# EAGLE design tiny_metal_detector (EAGLE 8.6.3)
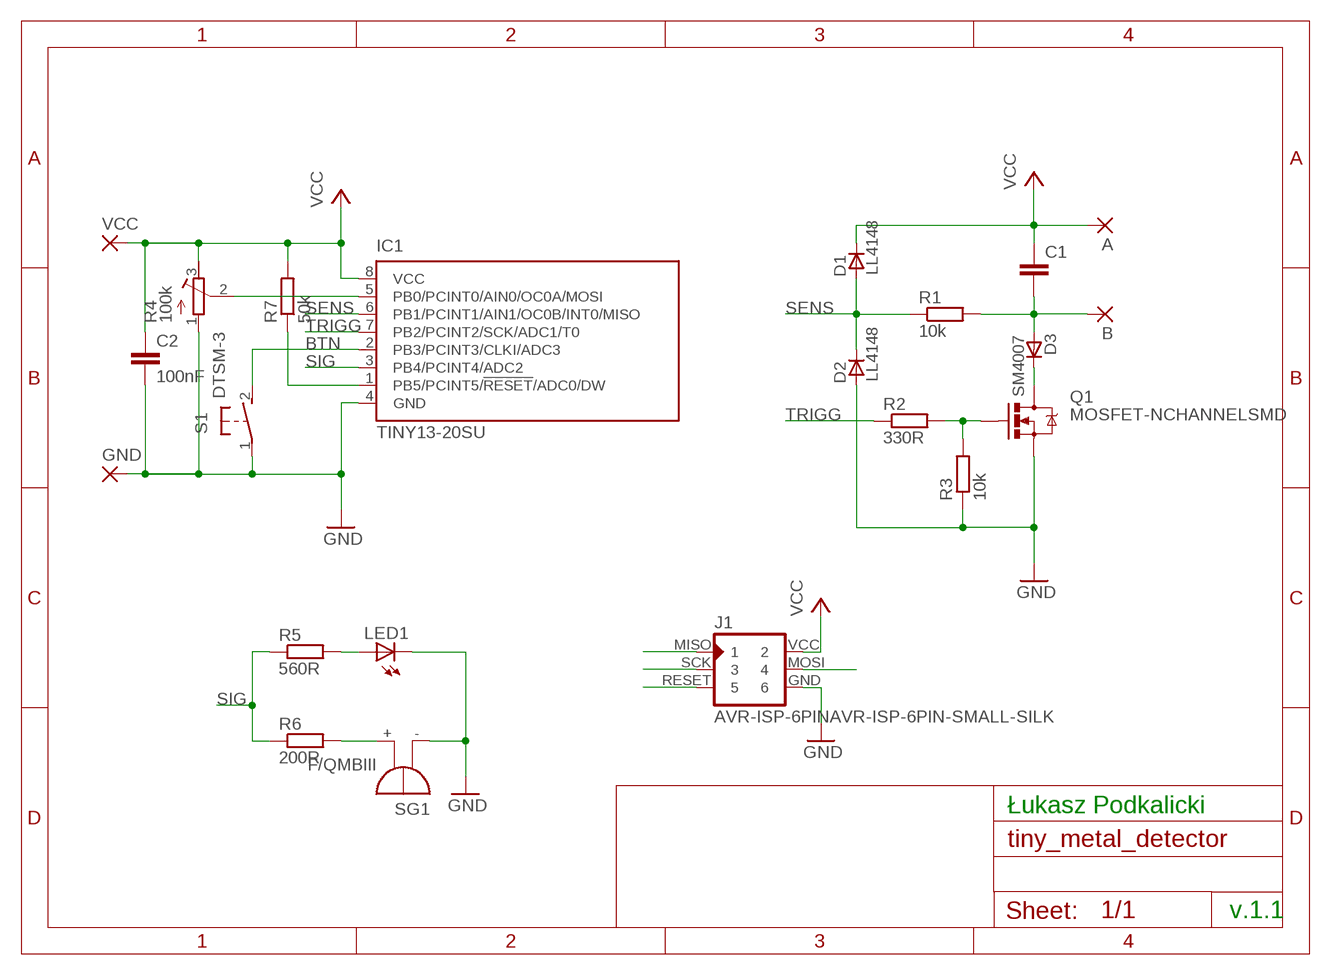
[diagram p0: schematic, sheet 1]
FRAME1 (DINA5_L): AUTHOR: Łukasz Podkalicki; SPICEPREFIX: X

## Parts
A  3,17/1,1  [3,17/1,1]
B  3,17/1,1  [3,17/1,1]
C1  C-EUC1206K  [C1206K]
C2  100nF  C-EUC1206K  [C1206K]
D1  LL4148  [SOD80_DO213AA_MINIMELF]
D2  LL4148  [SOD80_DO213AA_MINIMELF]
D3  SM4007  [MELF-MLL41_DO213AB]
GND  3,17/1,1  [3,17/1,1]
IC1  TINY13-20SU  [8S2]
J1  AVR-ISP-6PINAVR-ISP-6PIN-SMALL-SILK  [AVR-ISP-6PIN-SMAILL-SILK]
LED1  LEDCHIPLED_1206  [CHIPLED_1206]
Q1  MOSFET-NCHANNELSMD  [SOT23-3]
R1  10k  R-EU_R1206  [R1206]
R2  330R  R-EU_R1206  [R1206]
R3  10k  R-EU_R1206  [R1206]
R4  100k  R-TRIMM3296W  [RTRIM3296W]
R5  560R  R-EU_R1206  [R1206]
R6  200R  R-EU_R1206  [R1206]
R7  50k  R-EU_R1206  [R1206]
S1  DTSM-3  [DTSM-3]
SG1  F/QMBIII  [F/QMBIII]
VCC  3,17/1,1  [3,17/1,1]

## Nets
BTN: IC1.2(PB3/PCINT3/CLKI/ADC3) S1.2
GND: C2.2 D2.A GND.1(P) IC1.4(GND) J1.GND LED1.C Q1.2(S) R3.1 R4.1(A) S1.1 SG1.-(+)
MOSI: IC1.5(PB0/PCINT0/AIN0/OC0A/MOSI) J1.MOSI R4.2(S)
N$1: R6.2 SG1.+(-)
N$4: B.1(P) C1.2 D3.A R1.2
N$5: D3.C Q1.3(D)
N$6: Q1.1(G) R2.2 R3.2
N$7: LED1.A R5.2
RESET: IC1.1(PB5/PCINT5/!RESET!/ADC0/DW) J1.RESET R7.1
SENS: D1.A D2.C IC1.6(PB1/PCINT1/AIN1/OC0B/INT0/MISO) J1.MISO R1.1
SIG: IC1.3(PB4/PCINT4/ADC2) R5.1 R6.1
TRIGG: IC1.7(PB2/PCINT2/SCK/ADC1/T0) J1.SCK R2.1
VCC: A.1(P) C1.1 C2.1 D1.C IC1.8(VCC) J1.VCC R4.3(E) R7.2 VCC.1(P)

## Notes on the sheet
- Łukasz Podkalicki
- v.1.1

## Library data of the parts
A B GND VCC = wirepad:3,17/1,1: THROUGH-HOLE PAD
C1 C2 = rcl:C-EU: CAPACITOR, European symbol
D1 D2 = _hhn_diodes_smd:LL4148: 1N4148 General Purpose Rectifie SMD-Version of 1N4148 Case: SOD 80 = DO 213 AA = MINIMELF (Glass) Author: Dipl.-Ing. FH Rainer Bayer HHN Hochschule Heilbronn, rainer.bayer@hs-heilbronn.de Ingenieurbüro ing-rb, mail@ing-rb.de
D3 = _hhn_diodes_smd:SM400*: SM4001 .. SM4007 General Purpose Rectifier, 1 A SMD-Version of 1N4001 .. 1N4007 Case: MELF-MLL41 = DO 213 AB Author: Dipl.-Ing. FH Rainer Bayer HHN Hochschule Heilbronn, rainer.bayer@hs-heilbronn.de Ingenieurbüro ing-rb, mail@ing-rb.de
IC1 = atmel:TINY13: 8-bit AVR Microcontroller with 1K Bytes In-System Programmable Flash Source: http://www.atmel.com/dyn/resources/prod_documents/2535S.pdf; MPN: ATTINY13-20SU; OC_FARNELL: 9171568; OC_NEWARK: 96K6522
J1 = avr-isp:AVR-ISP-6PIN: AVR ISP 6pin 3x2 pin header
LED1 = led:LED: LED OSRAM: - CHIPLED LG R971, LG N971, LY N971, LG Q971, LY Q971, LO R971, LY R971 LH N974, LH R974 LS Q976, LO Q976, LY Q976 LO Q996 - Hyper CHIPLED LW Q18S LB Q993, LB Q99A, LB R99A - SideLED LS A670, LO A670, LY A670, LG A670, LP A670 LB A673, LV A673, LT A673, LW A673 LH A674 LY A675 LS A676, LA A676, LO A676, LY A676, LW A676 LS A679, LY A679, LG A679 - Hyper Micro SIDELED® LS Y876, LA Y876, LO Y876, LY Y876 LT Y87S - SmartLED LW L88C, LW L88S LB L89C, LB L89S, LG L890 LS L89K, LO L89K, LY L89K LS L896, LA L896, LO L896, LY L896 - TOPLED LS T670, LO T670, LY T670, LG T670, LP T670 LSG T670, LSP T670, LSY T670, LOP T670, LYG T670 LG T671, LOG T671, LSG T671 LB T673, LV T673, LT T673, LW T673 LH T674 LS T676, LA T676, LO T676, LY T676, LB T676, LH T676, LSB T676, LW T676 LB T67C, LV T67C, LT T67C, LS T67K, LO T67K, LY T67K, LW E67C LS E67B, LA E67B, LO E67B, LY E67B, LB E67C, LV E67C, LT E67C LW T67C LS T679, LY T679, LG T679 LS T770, LO T770, LY T770, LG T770, LP T770 LB T773, LV T773, LT T773, LW T773 LH T774 LS E675, LA E675, LY E675, LS T675 LS T776, LA T776, LO T776, LY T776, LB T776 LHGB T686 LT T68C, LB T68C - Hyper Mini TOPLED® LB M676 - Mini TOPLED Santana® LG M470 LS M47K, LO M47K, LY M47K Source: http://www.osram.convergy.de LUXEON: - LUMILED® LXK2-PW12-R00, LXK2-PW12-S00, LXK2-PW14-U00, LXK2-PW14-V00 LXK2-PM12-R00, LXK2-PM12-S00, LXK2-PM14-U00 LXK2-PE12-Q00, LXK2-PE12-R00, LXK2-PE12-S00, LXK2-PE14-T00, LXK2-PE14-U00 LXK2-PB12-K00, LXK2-PB12-L00, LXK2-PB12-M00, LXK2-PB14-N00, LXK2-PB14-P00, LXK2-PB14-Q00 LXK2-PR12-L00, LXK2-PR12-M00, LXK2-PR14-Q00, LXK2-PR14-R00 LXK2-PD12-Q00, LXK2-PD12-R00, LXK2-PD12-S00 LXK2-PH12-R00, LXK2-PH12-S00 LXK2-PL12-P00, LXK2-PL12-Q00, LXK2-PL12-R00 Source: www.luxeon.com KINGBRIGHT: KA-3528ASYC Source: www.kingbright.com
Q1 = fets:MOSFET-NCHANNEL: Generic NMOS footprint
R1-R3 R5-R7 = rcl:R-EU_: RESISTOR, European symbol
R4 = rcl:R-TRIMM: Trimm resistor
S1 = switch-tact-custom:DTSM-3
SG1 = buzzer:F/QMBIII: BUZZER Source: Buerklin; OC_FARNELL: unknown; OC_NEWARK: unknown

## Board
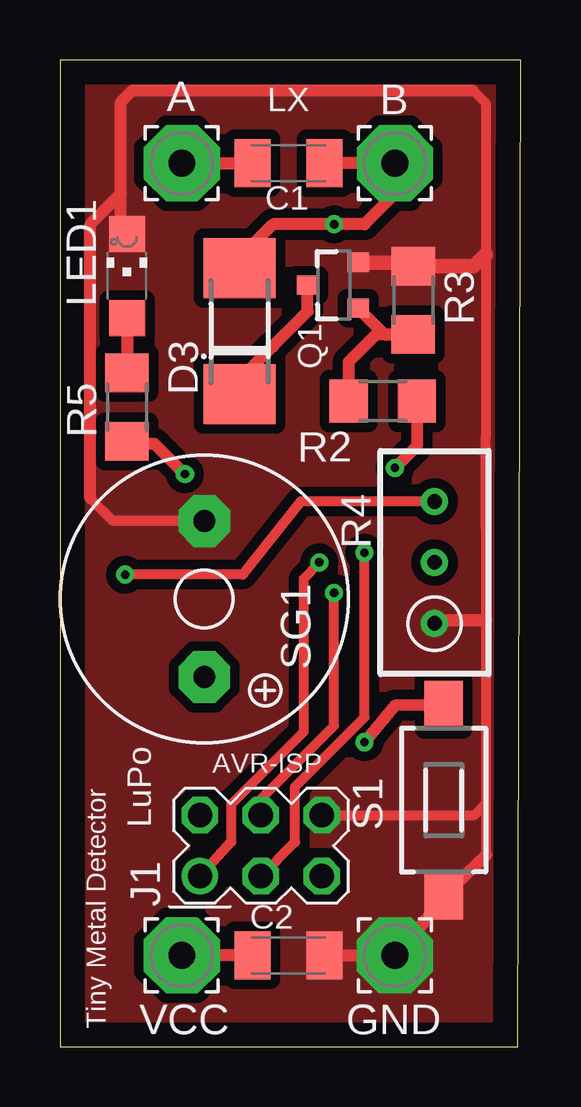
[diagram p1: board, top side]
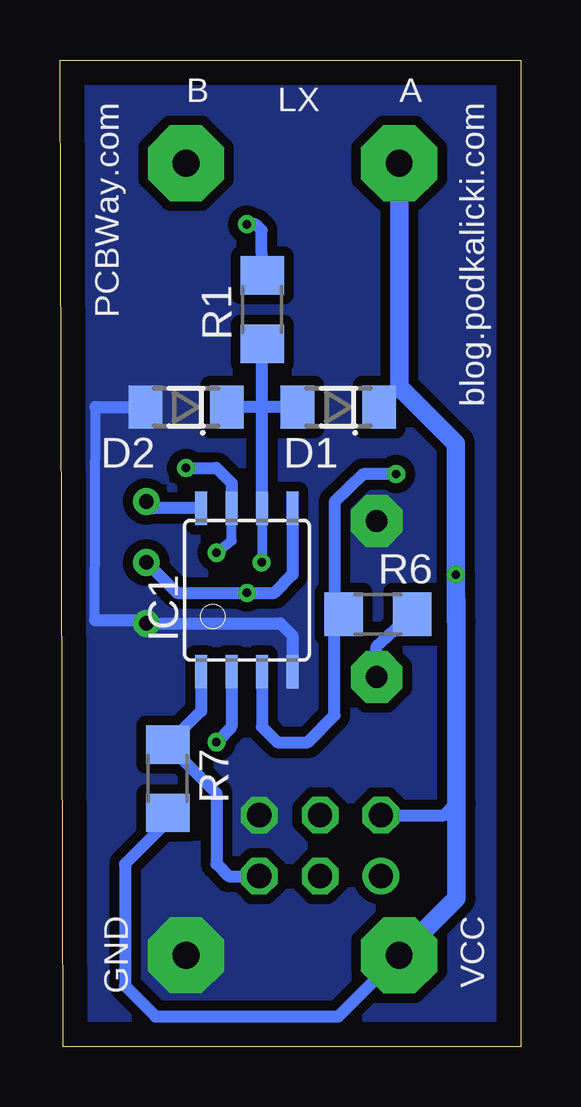
[diagram p2: board, bottom side, seen from below]

Size 19.23 x 41.14 mm. Coordinates in mm from the lower left corner, seen from the top.
Outline: 0,0 19.1,0 19.23,41.14 0,41.14 0,0
Copper layers (1*16): Top 0.035mm / dielectric 1.5mm / Bottom 0.035mm
Design rules "default": minimum track width 6mil, minimum drill 0.35mm, track to track 6mil, track to pad 6mil, pad to pad 6mil, via to via 6mil, smd to smd 6mil, copper to edge 40mil, drill to drill 6mil, minimum pad ring 10mil, minimum via ring 8mil, stop-mask expansion 4mil, vias tented up to drill 0mil, thermal gap 10mil

### Footprints (pad centres in the part's own frame; a part is rotated, then mirrored left to right if it is on the bottom)
3,17/1,1 = drill 1.118 pad 3.175 octagon: 1 0,0
C1206K = smd 1.5 x 2: 1 -1.5,0; 2 1.5,0
SOD80_DO213AA_MINIMELF = smd 1.4 x 1.8: A 1.7,0; C -1.7,0
MELF-MLL41_DO213AB = smd 2.5 x 3: A 2.625,0; C -2.625,0
8S2 = smd 0.5 x 1.4: 1 -1.905,-3.404; 2 -0.645,-3.404; 3 0.625,-3.404; 4 1.895,-3.404; 5 1.905,3.404; 6 0.635,3.404; 7 -0.635,3.404; 8 -1.905,3.404
AVR-ISP-6PIN-SMAILL-SILK = drill 1.016 octagon: GND 1.27,-2.54; MOSI 1.27,0; RESET -1.27,-2.54; SCK -1.27,0; VCC 1.27,2.54 | drill 1.016: MISO -1.27,2.54
CHIPLED_1206 = smd 1.5 x 1.5: A 0,-1.75; C 0,1.75
SOT23-3 = smd 0.8 x 0.9: 1 -0.95,-1; 2 0.95,-1; 3 0,1.1
R1206 = smd 1.6 x 1.803: 1 -1.422,0; 2 1.422,0
RTRIM3296W = drill 0.61: 1 0,-2.54; 2 0,0; 3 0,2.54
DTSM-3 = smd 2 x 1.6: 1 -3.97,0; 2 3.97,0
F/QMBIII = drill 0.914 pad 2.159 octagon: + 3.251,0; - -3.251,0

### Placement (x,y rotation side)
A  5.08,36.83 0 top
B  13.97,36.83 0 top
C1  9.53,36.83 0 top
C2  9.53,3.81 0 top
D1  7.62,26.67 180 bottom
D2  13.97,26.67 180 bottom
D3  7.49,29.84 90 top
GND  13.97,3.81 0 top
IC1  11.43,19.05 0 bottom
J1  8.38,8.38 90 top
LED1  2.79,32.13 0 top
Q1  11.43,31.75 90 top
R1  10.79,30.73 90 bottom
R2  13.46,26.92 180 top
R3  14.73,31.11 270 top
R4  15.62,20.19 0 top
R5  2.79,26.67 90 top
R6  5.97,18.03 0 bottom
R7  14.73,11.18 270 bottom
S1  16,10.29 90 top
SG1  6.02,18.67 270 top
VCC  5.08,3.81 0 top

### Tracks (layer width: path | path; a pad name or v marks a point on that pad's centre or on a via)
BTN  (via drill 0.35)
  Top 0.508: S1.2 13.97,14.22 v12.7,12.7
  Bottom 0.508: IC1.2 12.07,13.35 v12.7,12.7
GND
  Top 0.406: 17.78,8 17.78,10.16 | 17.78,10.16 17.78,15.25 17.78,17.78 17.75,25.4 17.75,33.02 17.75,39.33 17.21,39.87 | J1.GND 17.27,9.65 17.78,10.16 | SG1.- 2.21,21.92 1.27,22.86
  Top 0.508: C2.2 GND.1 15.11,5.11 S1.1 17.78,8 | 17.78,17.78 15.75,17.78 R4.1 | LED1.C 2.54,34.13 2.54,35.56 | 2.54,35.56 2.54,39.37 3.04,39.87 17.21,39.87 | 2.54,35.56 1.27,34.29 1.27,22.86
  Top 0.61: Q1.2 14.57,32.7 R3.1 17.27,32.54 17.75,33.02
  Bottom 0.406: 17.78,17.78 17.75,26.67
  Bottom 0.508: IC1.4 9.54,17.16 10.03,17.65 R4.1 15.75,17.78 17.78,17.78 | 17.75,26.67 D2.A | D2.A
  pour Bottom (isolate 0.406, no thermals): -0.25,41.53 19.05,41.4 19.05,0 0,0
  pour Top (isolate 0.406, no thermals): -1.27,41.91 20.32,41.91 20.32,-1.27 -1.27,-1.27
MOSI  (via drill 0.35)
  Top 0.406: J1.MOSI 8.36,9.75 8.36,10.31 11.43,13.38 v11.43,18.92
  Bottom 0.508: IC1.5 9.53,19.68 10.29,18.92 v11.43,18.92 14.35,18.92 R4.2
N$1
  Bottom 0.406: 5.94,16 SG1.+
  Bottom 0.508: SG1.+ 6.02,16.69 R6.2
N$4  (via drill 0.35)
  Top 0.508: 6.9,32.47 D3.A 7.49,32.89 8.89,34.29 v11.43,34.29 12.7,34.29 13.97,35.56 B.1 C1.2
  Bottom 0.508: R1.2 10.82,34.04 11.07,34.29 v11.43,34.29
N$5
  Top 0.508: D3.C 7.62,27.35 7.62,27.94 8.89,29.21 10.33,30.65 Q1.3
N$6
  Top 0.508: Q1.1 13.54,29.69 R3.2 13.18,29.69 12.04,28.55 R2.2
N$7
  Top 0.508: LED1.A R5.2
RESET
  Bottom 0.508: IC1.1 13.34,13.99 R7.1 12.7,10.57 12.7,7.62 12.19,7.11 J1.RESET
SENS  (via drill 0.35)
  Top 0.406: v10.82,20.19 10.16,19.51 10.16,13.14 7.14,10.12 7.14,8.53 J1.MISO
  Bottom 0.406: IC1.6 10.79,20.8 v10.82,20.19
  Bottom 0.508: IC1.6 10.79,26.67 | 10.79,26.67 R1.1 | D1.A 10.79,26.67 | 10.79,26.67 D2.C
SIG  (via drill 0.35)
  Top 0.508: R5.1 2.79,25.15 3.94,25.15 v5.21,23.88
  Bottom 0.406: 7.62,17.8 R6.1
  Bottom 0.508: IC1.3 10.8,13.35 10.16,12.7 8.89,12.7 7.77,13.82 7.77,17.65 7.62,17.8 | v5.21,23.88 6.58,23.88 7.77,22.71 7.77,18.41 R6.1
TRIGG  (via drill 0.35)
  Top 0.406: J1.SCK 9.8,8.53 9.8,10.84 12.7,13.74 v12.7,20.6
  Top 0.508: R2.1 14.88,25.04 v13.97,24.13
  Bottom 0.406: v12.7,20.6 12.06,21.11 IC1.7
  Bottom 0.508: v13.97,24.13 12.7,24.13 12.06,23.5 IC1.7
VCC  (via drill 0.35)
  Top 0.406: R4.3 10.03,22.73 7.62,19.68 v2.72,19.68
  Top 0.508: C2.1 VCC.1 | A.1 C1.1
  Bottom 0.508: IC1.8 15.34,22.45 R4.3 | D1.C 5.08,27.51 | 3.83,3.81 VCC.1 7.62,1.27 15.24,1.27 16.51,2.54 16.51,7.62 14.73,9.4 R7.2 14.73,9.65 | v2.72,19.68 2.72,17.78 2.85,17.78 | J1.VCC 3.2,9.65 2.69,10.16
  Bottom 0.762: A.1 5.08,27.51 2.72,25.15 2.72,17.78 | VCC.1 2.69,6.2 2.69,10.16 2.69,17.75 v2.72,19.68 2.72,17.78 | 2.72,17.78

### Text on the board
tNames: LX | AVR-ISP | LuPo | Tiny Metal Detector
bNames: blog.podkalicki.com | A | LX | B | PCBWay.com | VCC | GND